# EAGLE design MKR2UNO (EAGLE 7.6.0)
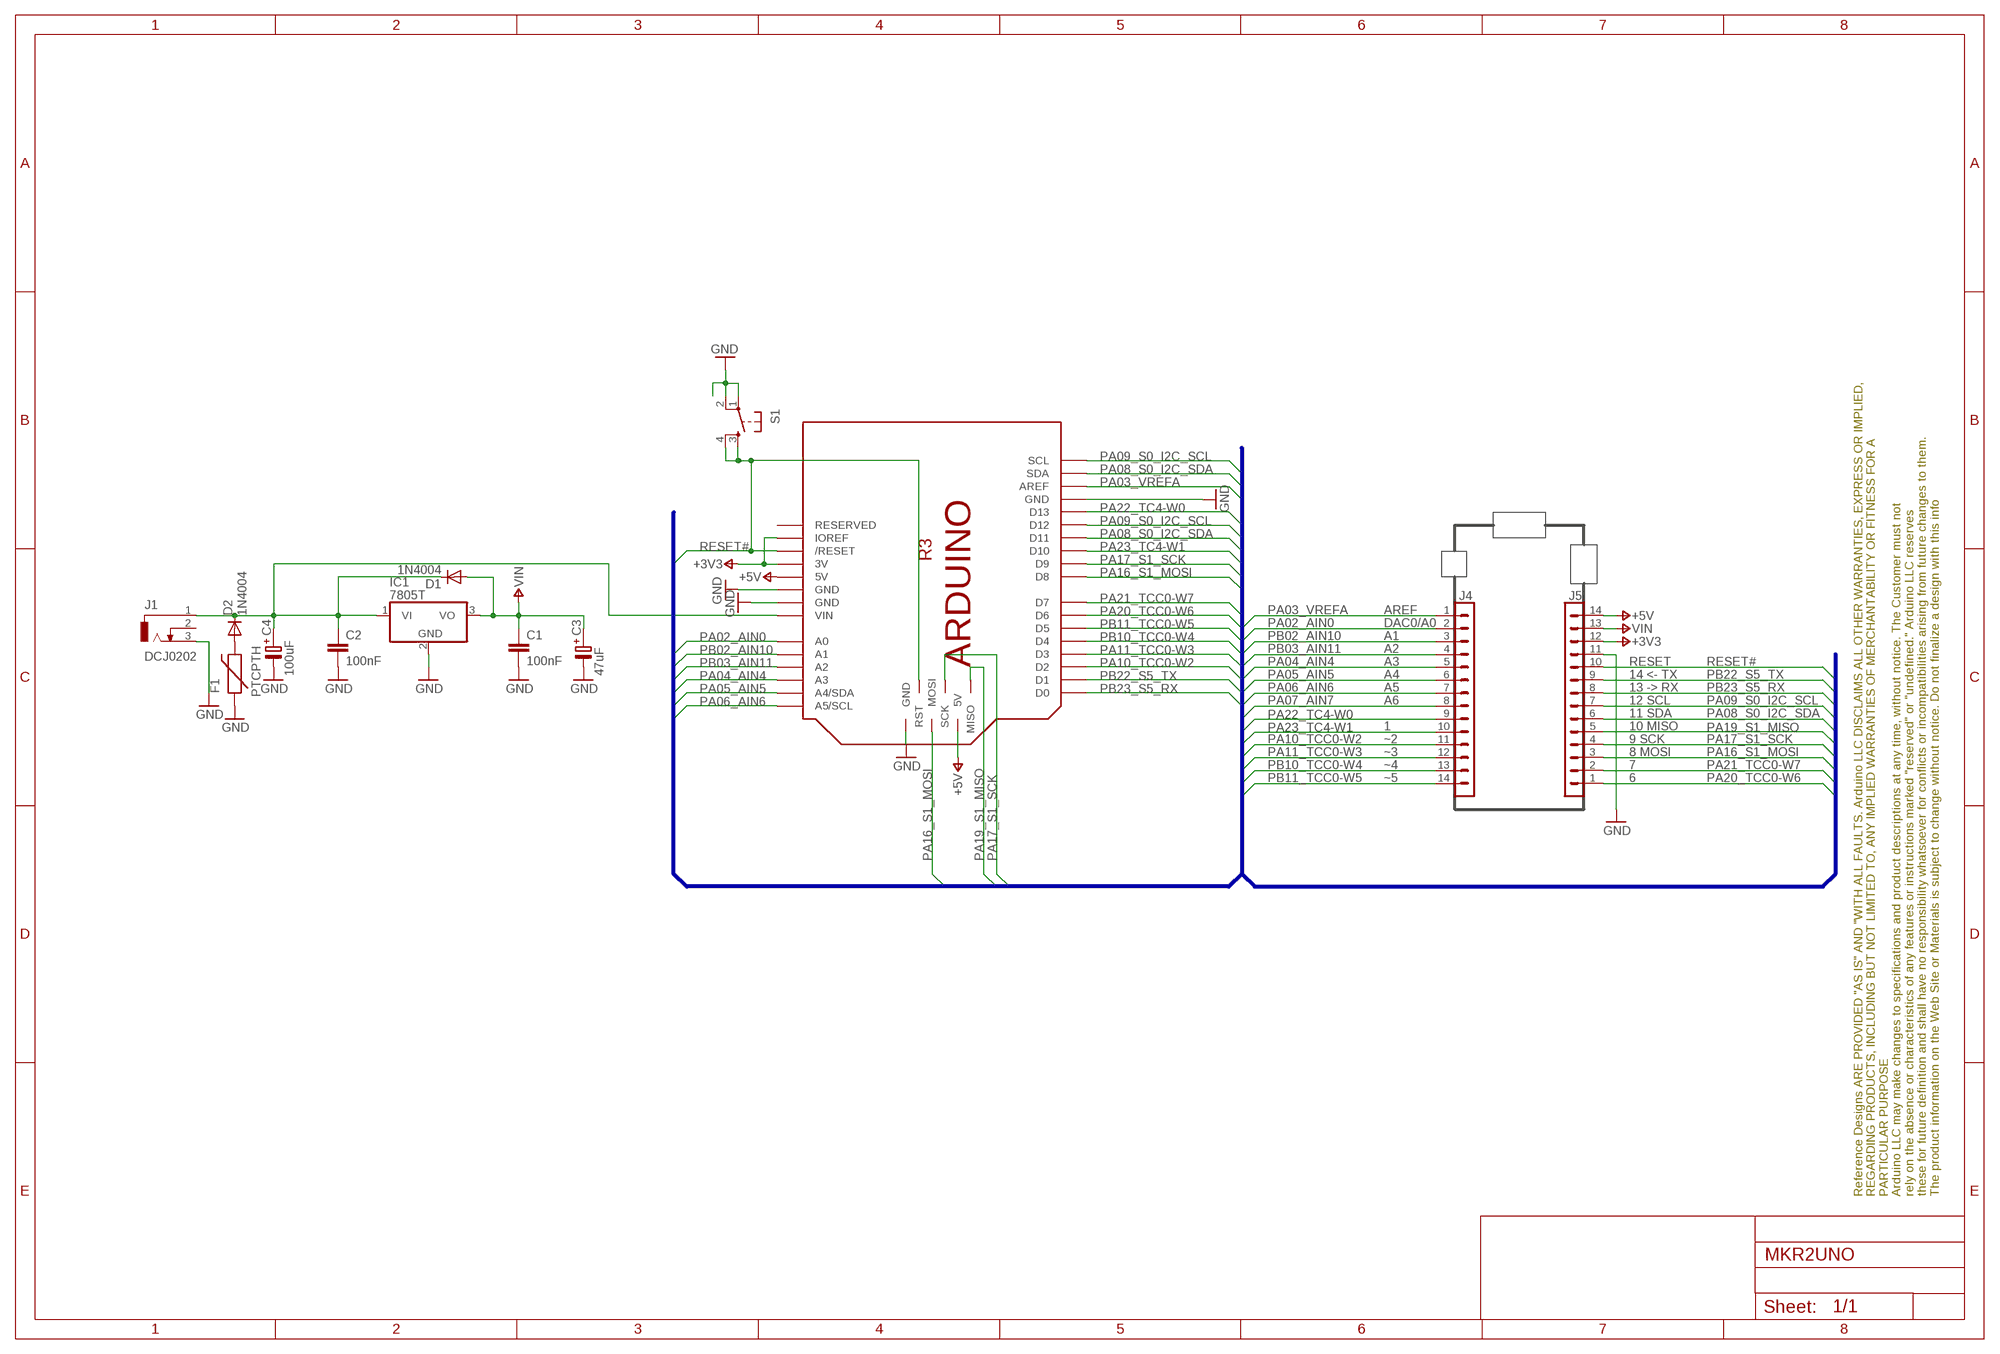
[diagram p0: schematic, sheet 1]

## Parts
C1  100nF  C-EU025-024X044  [C025-024X044]
C2  100nF  C-EU025-024X044  [C025-024X044]
C3  47uF  C-PA-6,3X10  [EA6,3-10]
C4  100uF  C-PA-6,3X10  [EA6,3-10]
D1  1N4004  [DO41-10]
D2  1N4004  [DO41-10]
F1  PTCPTH  [PTC]
FRAME1  Page 1  A3L-LOC  [FRAME]
IC1  7805T  [TO220H]
J1  DCJ0202  [DCJ0202]
J4  DNP  STRIP-14STD  [1X14]
J5  DNP  STRIP-14STD  [1X14]
M1  ARDUINO_R3_ICSP  [ARDUINOR3_ICSP]
S1  TAC_SWITCHPTH  [TACTILE-PTH]

## Nets
+3V3: J5.12 M1.3V M1.IOREF
+5V: J5.14 M1.5V M1.5V_ICSP(5V)
GND: C1.2 C2.2 C3.- C4.- F1.P$1 IC1.2(GND) J1.3 J5.11 M1.GND M1.GND@1(GND) M1.GND@2(GND) M1.GND@3(GND) S1.1 S1.2
N$1: C2.1 C4.+ D1.C D2.C IC1.1(VI) J1.1 M1.VIN
N$2: D2.A F1.P$2
PA02_AIN0: J4.2 M1.A0
PA03_VREFA: J4.1 M1.AREF
PA04_AIN4: J4.5 M1.A3
PA05_AIN5: J4.6 M1.A4(A4/SDA)
PA06_AIN6: J4.7 M1.A5(A5/SCL)
PA07_AIN7: J4.8
PA08_S0_I2C_SDA: J5.6 M1.D11 M1.SDA
PA09_S0_I2C_SCL: J5.7 M1.D12 M1.SCL
PA10_TCC0-W2: J4.11 M1.D2
PA11_TCC0-W3: J4.12 M1.D3
PA16_S1_MOSI: J5.3 M1.D8 M1.MOSI
PA17_S1_SCK: J5.4 M1.D9 M1.SCK
PA19_S1_MISO: J5.5 M1.MISO
PA20_TCC0-W6: J5.1 M1.D6
PA21_TCC0-W7: J5.2 M1.D7
PA22_TC4-W0: J4.9 M1.D13
PA23_TC4-W1: J4.10 M1.D10
PB02_AIN10: J4.3 M1.A1
PB03_AIN11: J4.4 M1.A2
PB10_TCC0-W4: J4.13 M1.D4
PB11_TCC0-W5: J4.14 M1.D5
PB22_S5_TX: J5.9 M1.D1
PB23_S5_RX: J5.8 M1.D0
RESET#: J5.10 M1.RESET(/RESET) M1.RESET_ICSP(RST) S1.3 S1.4
VIN: C1.1 C3.+ D1.A IC1.3(VO) J5.13
Unconnected: J1.2 M1.RESERVED

## Buses
PA03_VREFA,PA02_AIN0,PB02_AIN10,PB03_AIN11PA04_AIN4,PA05_AIN5,PA06_AIN6,PA07_AIN7,PA22_TC4-W0,PA23_TC4-W1,PA10_TCC0-W2,PA11_TCC0-W3,PB10_TCC0-W4,PB11_TCC0-W5,PA20_TCC0-W6,PA21_TCC0-W7,PA16_S1_MOSI,PA17_S1_SCK,PA19_S1_MISO,PA08_S0_I2C_SDA,PA09_S0_I2C_SCL,PB23_S5_RX,PB22_S5_TX,RESET#

## Notes on the sheet
- AREF
- DAC0/A0
- A1
- A2
- A3 | RESET
- A4 | 14 <- TX
- A5 | 13 -> RX
- A6 | 12 SCL
- 11 SDA
- 1 | 10 MISO
- ~2 | 9 SCK
- ~3 | 8 MOSI
- ~4 | 7
- ~5 | 6

## Library data of the parts
C1 C2 = rcl:C-EU: CAPACITOR, European symbol
C3 C4 = cap-pan40:C-PA: POLARIZED AXIAL ELECTROLYTIC
D1 D2 = diode:1N4004: DIODE general purpose rectifier, 1 A
F1 = SparkFun:PTC: Resettable Fuse PTC Resettable Fuse. Spark Fun Electronics SKU : COM-08357
FRAME1 = Arduino-utility:A3L-LOC: FRAME DIN A3, landscape with location and doc. field
IC1 = linear:78*: Positive VOLTAGE REGULATOR Source: http://cache.national.com/ds/LM/LM78L05.pdf http://www.fairchildsemi.com/ds/LM/LM7805.pdf
J1 = con-jack:DCJ0202: DC POWER JACK Source: DCJ0202.pdf
J4 J5 = Arduino-connectors:STRIP-14
M1 = Arduino-BoardFootprints:ARDUINO_R3_ICSP
S1 = SparkFun:TAC_SWITCH: Momentary Switch Button commonly used for reset or general input. Spark Fun Electronics SKU : COM-00097

## Net classes
0 default: width 0.25 mm, drill 0.25 mm

## Board
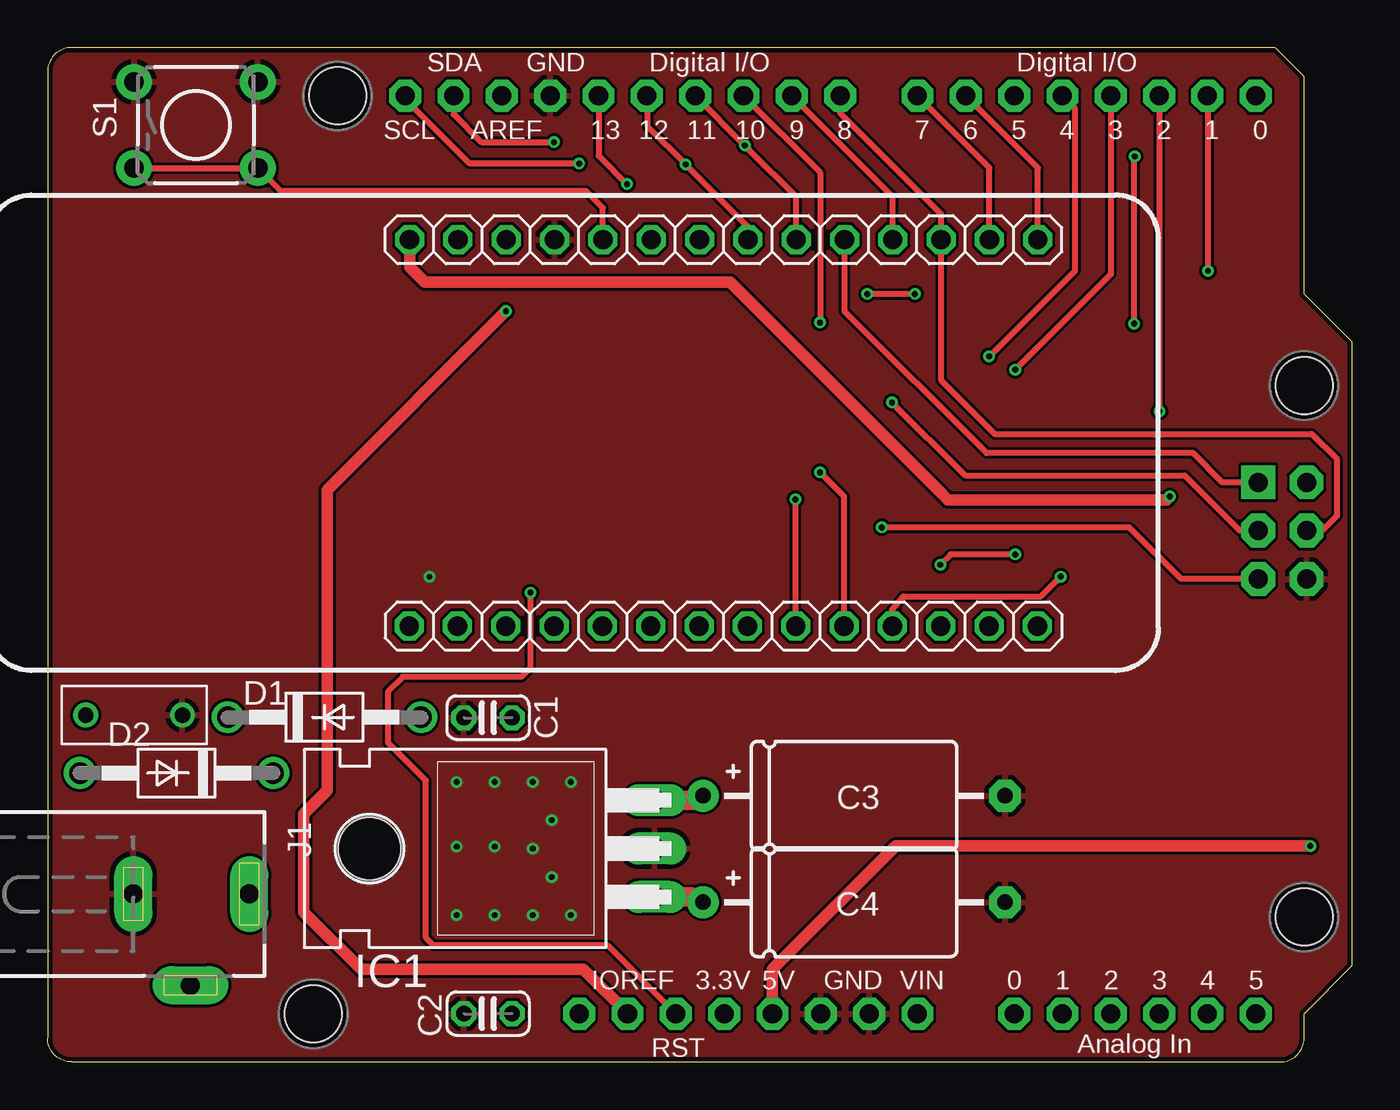
[diagram p1: board, top side]
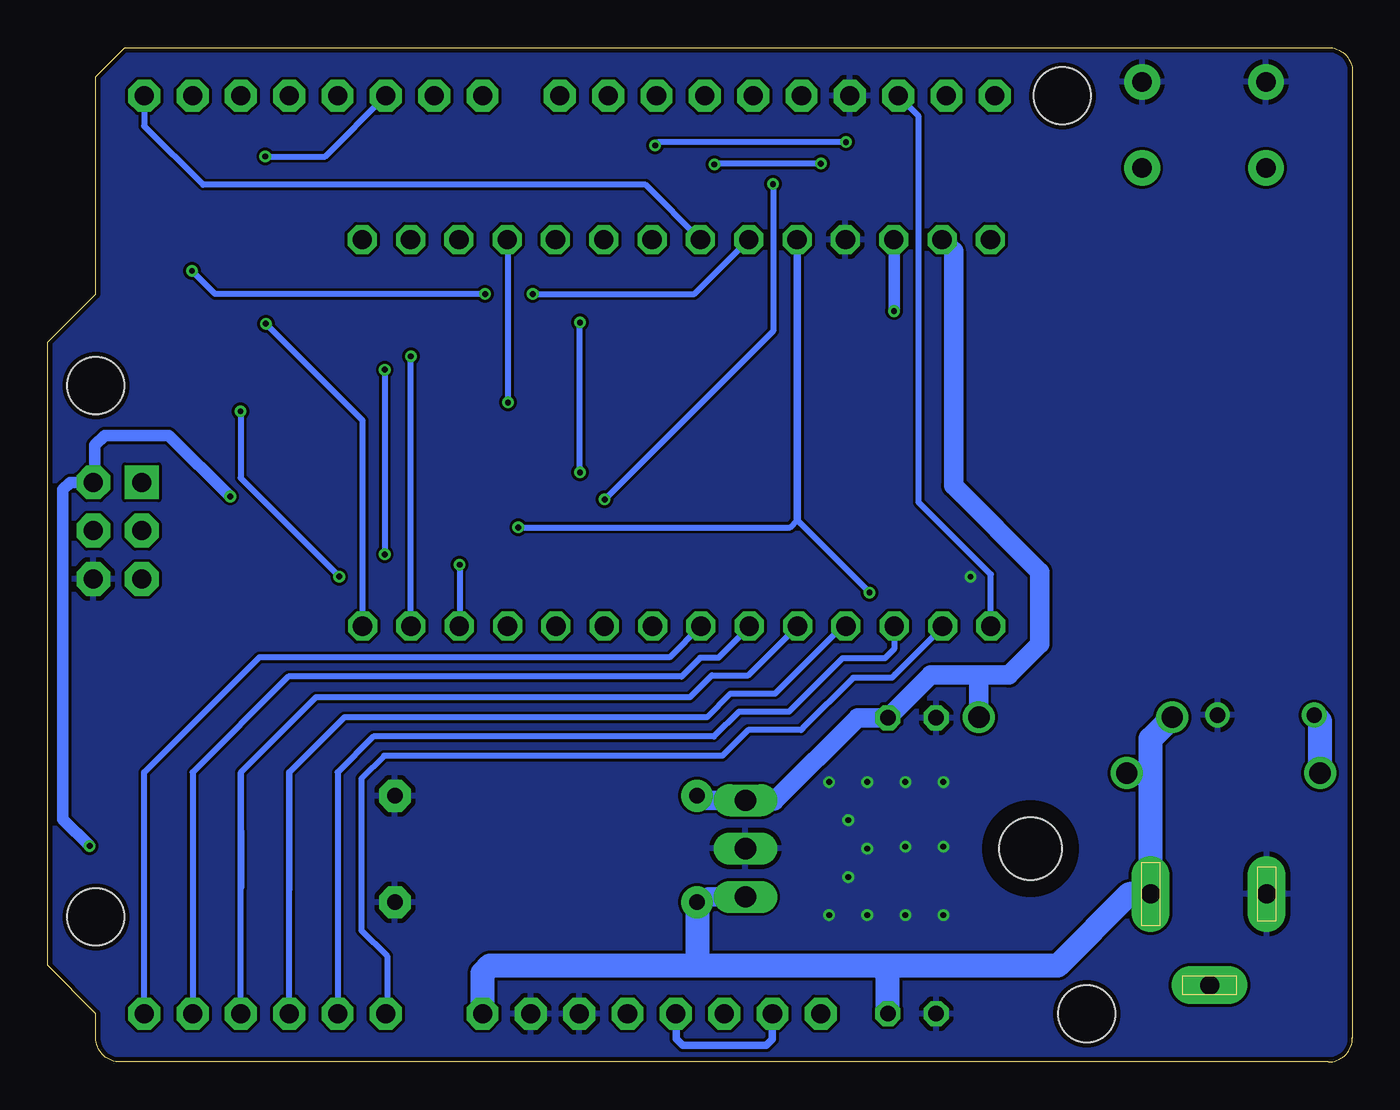
[diagram p2: board, bottom side, seen from below]

Size 68.58 x 53.34 mm. Coordinates in mm from the lower left corner, seen from the top.
Copper layers (1*16): Top 0.035mm / dielectric 1.5mm / Bottom 0.035mm
Design rules "SeeedStudio_2layers *": minimum track width 6mil, minimum drill 12mil, track to track 6mil, track to pad 6mil, pad to pad 6mil, via to via 6mil, smd to smd 0mil, copper to edge 10mil, drill to drill 10mil, minimum pad ring 10mil, minimum via ring 6mil, stop-mask expansion 2mil, vias tented up to drill 100mil, thermal gap 10mil

### Footprints (pad centres in the part's own frame; a part is rotated, then mirrored left to right if it is on the bottom)
C025-024X044 = drill 0.813 octagon: 1 -1.27,0; 2 1.27,0
EA6,3-10 = drill 0.813 pad 1.676: + -8.255,0 | drill 0.813 pad 1.676 octagon: - 7.62,0
DO41-10 = drill 1.118: A 5.08,0; C -5.08,0
PTC = drill 0.8: P$1 -2.54,0; P$2 2.54,0
TO220H = drill 1.118 long: 1 -2.54,-10.16; 2 0,-10.16; 3 2.54,-10.16 | hole 3.302: 0,4.826
DCJ0202 = drill 1 pad 2 long: 1 0,3.1; 2 4.8,0; 3 0,-3
1X14 = drill 1.016 octagon: 1 -16.51,0; 2 -13.97,0; 3 -11.43,0; 4 -8.89,0; 5 -6.35,0; 6 -3.81,0; 7 -1.27,0; 8 1.27,0; 9 3.81,0; 10 6.35,0; 11 8.89,0; 12 11.43,0; 13 13.97,0; 14 16.51,0
ARDUINOR3_ICSP = drill 1 pad 1.676 octagon: 3V 35.56,2.54; 5V 38.1,2.54; A0 50.8,2.54; A1 53.34,2.54; A2 55.88,2.54; A3 58.42,2.54; A4 60.96,2.54; A5 63.5,2.54; AREF 23.876,50.8; D0 63.5,50.8; D1 60.96,50.8; D2 58.42,50.8; D3 55.88,50.8; D4 53.34,50.8; D5 50.8,50.8; D6 48.26,50.8; D7 45.72,50.8; D8 41.656,50.8; D9 39.116,50.8; D10 36.576,50.8; D11 34.036,50.8; D12 31.496,50.8; D13 28.956,50.8; GND 26.416,50.8; GND@1 43.18,2.54; GND@2 40.64,2.54; IOREF 30.48,2.54; RESERVED 27.94,2.54; RESET 33.02,2.54; SCL 18.796,50.8; SDA 21.336,50.8; VIN 45.72,2.54 | drill 1 pad 1.778 octagon: 5V_ICSP 66.167,30.48; GND@3 66.167,25.4; MOSI 66.167,27.94; RESET_ICSP 63.627,25.4; SCK 63.627,27.94 | drill 1 pad 1.778 square: MISO 63.627,30.48 | hole 3: 15.24,50.8; 13.97,2.54; 66.04,7.62; 66.04,35.56
TACTILE-PTH = drill 1.016 pad 1.88: 1 -3.251,2.261; 2 3.251,2.261; 3 -3.251,-2.261; 4 3.251,-2.261

### Placement (x,y rotation side)
C1  23.15,18.1 180 top
C2  23.15,2.54 180 top
C3  42.7,14 0 top
C4  42.7,8.4 0 top
D1  14.55,18.13 0 top
D2  6.78,15.19 180 top
F1  4.55,18.24 180 top
FRAME1  -18.64,1.98 0 top  (outside the outline)
IC1  21.74,11.22 90 top
J1  7.51,8.83 270 top
J4  35.51,22.92 0 top
J5  35.53,43.24 180 top
M1  0,0 0 top
S1  7.8,49.27 0 top

### Tracks (layer width: path | path; a pad name or v marks a point on that pad's centre or on a via)
+3V3  (via drill 0.3 pad 0.61)
  Top 0.61: M1.IOREF 28.16,4.87 16.48,4.87 13.47,7.88 13.47,13.05 14.69,14.27 14.69,30.08 v24.09,39.48 24.07,39.5
  Bottom 0.406: M1.IOREF 30.48,1.19 30.8,0.87 35.19,0.87 35.54,1.22 35.54,2.52 M1.3V
  Bottom 0.61: v24.09,39.48 24.09,43.23 J5.12
+5V  (via drill 0.3, 0.3 pad 0.61)
  Top 0.61: v58.98,29.73 58.81,29.56 47.31,29.56 47.04,29.83 47.04,29.84 35.87,41.01 19.82,41.01 19.02,41.8 J5.14 | v66.37,11.36 46.92,11.36 46.91,11.37 44.59,11.37 38.1,4.88 M1.5V
  Bottom 0.61: v58.98,29.73 62.2,32.95 65.58,32.95 66.1,32.43 66.1,30.55 M1.5V_ICSP 67.4,30.48 67.77,30.11 67.77,12.76 v66.37,11.36
GND  (via drill 0.3)
  other vias: 27.5,7.72 25.5,7.72 23.5,7.72 21.5,7.72 27.5,14.72 26.5,12.72 26.5,9.72 25.5,11.22 23.5,11.32 21.5,11.32 25.5,14.72 23.5,14.72 21.5,14.72 20.07,25.51
  pour Bottom: 0,55 70,55 70,0 0,0
  pour Top: 0,55 70,55 70,0 0,0
N$1
  Top 1.016: IC1.1 33.84,8.68 C4.+
  Bottom 0.406: 16.69,5.07 16.74,5.07 16.74,5.4
  Bottom 1.016: 34.12,5.13 34.05,5.07 | C4.+ 33.84,8.68 31.82,8.68
  Bottom 1.27: M1.VIN 45.72,4.67 45.32,5.07 34.05,5.07 24.85,5.07 | 24.85,5.07 16.69,5.07 16.68,5.06 15.5,5.06 11.73,8.83 J1.1 10.61,14.94 | C2.1 24.42,4.64 24.85,5.07 | 10.61,14.94 10.61,16.99 D1.C | C4.+ 34.45,5.46 34.12,5.13 | D2.C 10.86,15.19 10.61,14.94
N$2
  Bottom 1.27: D2.A 1.7,17.93 F1.P$2
PA02_AIN0
  Bottom 0.305: J4.2 21.55,22.88 24.03,20.39 24.03,20.38 24.21,20.2 26.24,20.2 28.88,17.56 28.88,17.55 28.98,17.45 31.76,17.45 33.11,16.1 50.89,16.1 52.09,14.9 52.09,6.92 50.74,5.57 50.74,2.6 M1.A0
PA03_VREFA
  Bottom 0.305: M1.AREF 22.8,49.72 22.8,29.43 19,25.64 J4.1
PA04_AIN4
  Bottom 0.305: 58.49,2.61 M1.A3 58.42,15.23 | J4.5 31.75,20.33 33.66,20.33 34.82,19.17 54.48,19.17 58.42,15.23 | 58.42,15.23 58.41,9.15
PA05_AIN5
  Bottom 0.305: 31.68,22.89 J4.6 31.7,22.86 33.32,21.25 34.28,21.25 35.26,20.27 55.92,20.27 60.96,15.23 M1.A4
PA06_AIN6
  Bottom 0.305: 34.23,22.91 J4.7 35.88,21.28 57.45,21.28 63.5,15.23 M1.A5
PA08_S0_I2C_SDA  (via drill 0.3, 0.3 pad 0.6)
  Top 0.305: J5.6 39.34,45.49 36.89,47.95 v36.65,48.19 M1.D11 | M1.SDA 21.34,49.83 22.8,48.37 v26.62,48.37
  Bottom 0.305: 39.27,43.32 J5.6 | v26.62,48.37 36.47,48.37 v36.65,48.19
PA09_S0_I2C_SCL  (via drill 0.3, 0.3 pad 0.6)
  Top 0.305: J5.7 36.79,43.23 36.78,43.23 36.78,43.95 33.81,46.92 v33.53,47.2 31.55,49.18 31.55,50.75 M1.D12 | M1.SCL 18.8,50.62 22.17,47.25 v27.93,47.25 v27.94,47.24
  Bottom 0.305: v27.94,47.24 33.49,47.24 v33.53,47.2
PA10_TCC0-W2  (via drill 0.3 pad 0.6)
  Top 0.305: M1.D2 58.43,47.9 v58.43,34.22 v58.44,34.21 | J4.11 44.38,22.95 44.38,23.78 44.98,24.48 52.21,24.48 53.02,25.29 | 53.02,25.29 53.02,25.28 | 53.02,25.29 v53.25,25.52
  Bottom 0.305: v58.44,34.21 58.44,30.71 v53.25,25.52
PA11_TCC0-W3  (via drill 0.3)
  Top 0.305: v50.86,26.69 47.46,26.69 v46.92,26.15 | M1.D3 55.88,41.42 v50.86,36.4
  Bottom 0.305: v50.86,36.4 v50.86,26.69 | v46.92,26.15 46.92,22.95 J4.12
PA16_S1_MOSI
  Top 0.305: 46.98,43.22 46.98,35.83 49.78,33.03 66.44,33.03 67.78,31.69 67.78,28.73 66.99,27.94 M1.MOSI | M1.D8 41.66,49.89 46.97,44.59 J5.3
  Top 0.406: 46.98,43.22 J5.3
PA17_S1_SCK  (via drill 0.3)
  Top 0.305: 44.39,43.2 J5.4 44.42,45.49 M1.D9 | M1.SCK 62.66,27.94 59.76,30.84 48.22,30.84 v44.38,34.68
  Bottom 0.305: v44.38,34.68 44.38,43.2
  Bottom 0.406: 44.38,43.2 J5.4
PA19_S1_MISO
  Top 0.305: M1.MISO 61.75,30.48 60.22,32.01 49.35,32.01 41.88,39.48 J5.5
PA20_TCC0-W6
  Top 0.305: J5.1 52.05,47.02 M1.D6
PA21_TCC0-W7
  Top 0.305: J5.2 49.51,47.02 M1.D7
PA22_TC4-W0  (via drill 0.3 pad 0.6)
  Top 0.305: M1.D13 28.96,47.65 v30.45,46.16 | v39.3,29.58 39.3,22.95 J4.9
  Bottom 0.305: v30.45,46.16 30.45,38.43 v39.3,29.58
PA23_TC4-W1  (via drill 0.3 pad 0.6)
  Top 0.305: M1.D10 40.6,46.78 v40.6,38.88 | J4.10 41.87,29.73 v40.6,31
  Bottom 0.305: v40.6,31 v40.6,38.88
PB02_AIN10
  Bottom 0.305: J4.3 24.09,21.7 24.57,21.22 26.81,21.22 29.6,18.43 32.24,18.43 33.56,17.11 51.46,17.11 53.34,15.23 M1.A1
PB03_AIN11
  Bottom 0.305: 55.95,2.61 M1.A2 55.88,15.23 | J4.4 26.79,22.92 30.34,19.37 32.69,19.37 33.93,18.13 52.98,18.13 55.88,15.23 | 55.88,15.23 55.89,9.02
PB10_TCC0-W4  (via drill 0.3)
  Top 0.305: v49.48,37.1 54,41.62 54,50.14 M1.D4
  Bottom 0.305: J4.13 v49.48,37.1
PB11_TCC0-W5  (via drill 0.3 pad 0.6)
  Top 0.305: v57.11,38.82 57.11,47.58 v57.14,47.61
  Bottom 0.305: J4.14 52.02,33.73 v57.11,38.82 | v57.14,47.61 53.99,47.61 M1.D5
PB22_S5_TX  (via drill 0.3)
  Top 0.305: v45.58,40.38 v43.08,40.38 | v60.99,41.6 60.99,50.77 M1.D1
  Bottom 0.305: v43.08,40.38 34.59,40.38 J5.9 | 45.58,40.28 v45.58,40.38 59.77,40.38 v60.99,41.6
PB23_S5_RX
  Bottom 0.305: M1.D0 63.5,49.21 60.41,46.12 37.15,46.12 J5.8
RESET#  (via drill 0.3, 0.3 pad 0.6)
  Top 0.305: M1.RESET 29.43,6.13 20.28,6.13 19.88,6.53 19.88,14.8 17.91,16.77 17.91,19.5 18.66,20.25 24.9,20.25 25.38,20.73 v25.38,24.68 | S1.3 S1.4 12.27,45.79 28.31,45.79 29.18,44.91 J5.10 | M1.RESET_ICSP 59.57,25.4 56.86,28.11 v43.84,28.11
  Bottom 0.305: v25.38,24.68 29.18,28.48 29.56,28.11 v43.84,28.11
  Bottom 0.406: J5.10 29.18,28.48
VIN
  Top 1.016: IC1.3 33.88,13.76 C3.+
  Bottom 1.016: J5.13 20.96,42.63 20.96,30.3 16.43,25.77 16.43,21.97 18.05,20.35 19.64,20.35 | C3.+ 33.88,13.76 31.76,13.76 31.74,13.74 | IC1.3 31.04,13.72 30.38,13.72 26,18.1 C1.1 22.17,20.35 19.64,20.35 | 19.64,20.35 19.71,20.28 19.63,20.2 D1.A